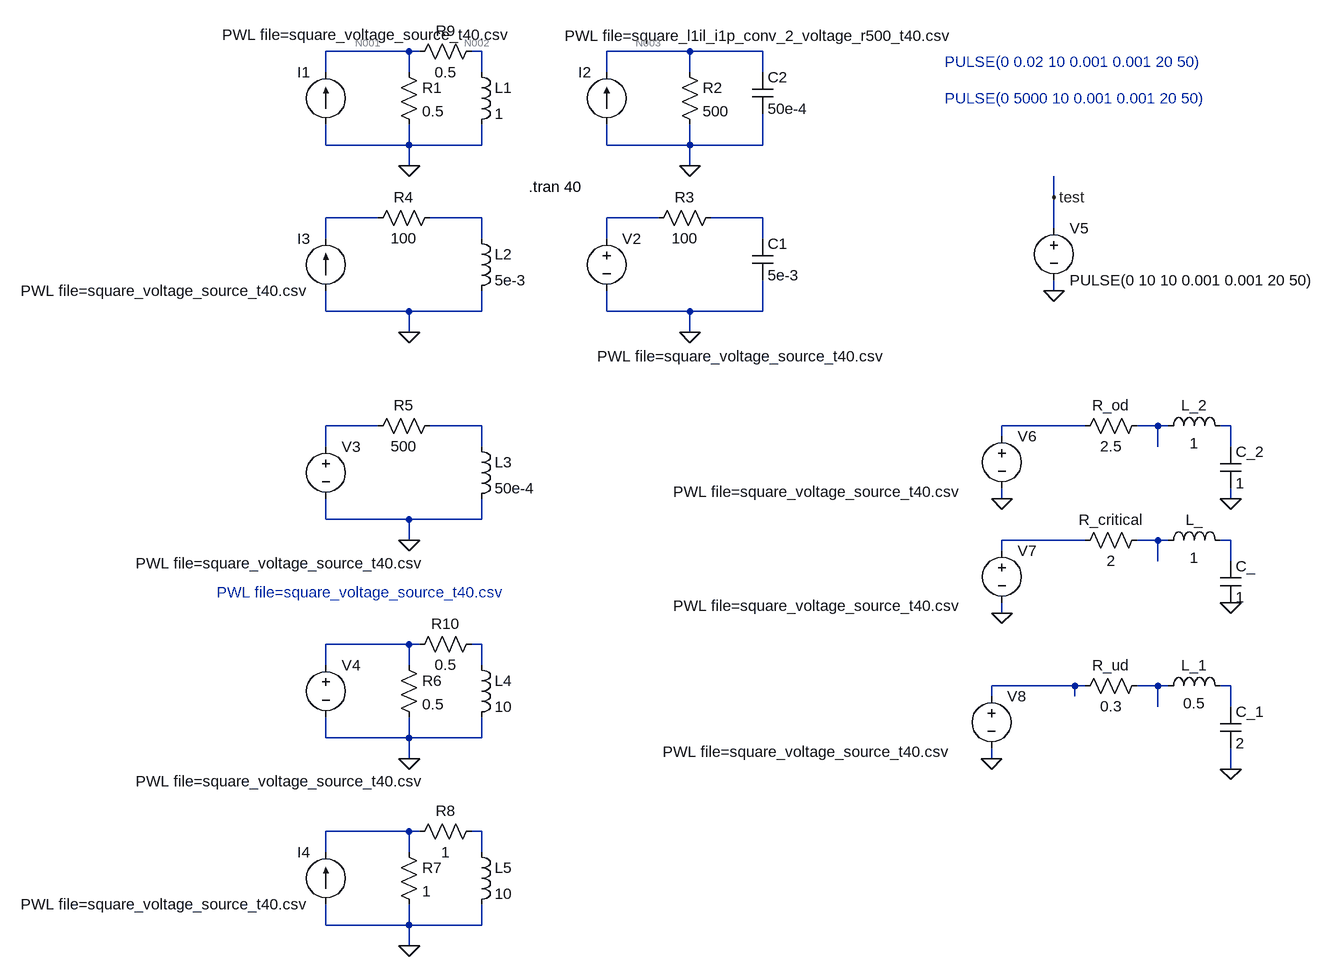
[diagram p0: schematic source_conversions.asc]
source_conversions.asc, the LTspice schematic file:
Version 4.1
SHEET 1 3944 1364
WIRE 336 -64 208 -64
WIRE 352 -64 336 -64
WIRE 448 -64 432 -64
WIRE 768 -64 640 -64
WIRE 880 -64 768 -64
WIRE 208 -32 208 -64
WIRE 336 -32 336 -64
WIRE 448 -32 448 -64
WIRE 640 -32 640 -64
WIRE 768 -32 768 -64
WIRE 880 -32 880 -64
WIRE 208 80 208 48
WIRE 336 80 336 48
WIRE 336 80 208 80
WIRE 448 80 448 48
WIRE 448 80 336 80
WIRE 640 80 640 48
WIRE 768 80 768 48
WIRE 768 80 640 80
WIRE 880 80 880 32
WIRE 880 80 768 80
WIRE 336 112 336 80
WIRE 768 112 768 80
WIRE 1328 160 1328 128
WIRE 288 192 208 192
WIRE 448 192 368 192
WIRE 720 192 640 192
WIRE 880 192 800 192
WIRE 1328 208 1328 160
WIRE 208 224 208 192
WIRE 448 224 448 192
WIRE 640 224 640 192
WIRE 880 224 880 192
WIRE 1328 304 1328 288
WIRE 208 336 208 304
WIRE 336 336 208 336
WIRE 448 336 448 304
WIRE 448 336 336 336
WIRE 640 336 640 304
WIRE 768 336 640 336
WIRE 880 336 880 288
WIRE 880 336 768 336
WIRE 336 368 336 336
WIRE 768 368 768 336
WIRE 288 512 208 512
WIRE 448 512 368 512
WIRE 1376 512 1248 512
WIRE 1488 512 1456 512
WIRE 1504 512 1488 512
WIRE 1600 512 1584 512
WIRE 1248 528 1248 512
WIRE 208 544 208 512
WIRE 448 544 448 512
WIRE 1488 544 1488 512
WIRE 1600 544 1600 512
WIRE 1248 624 1248 608
WIRE 1600 624 1600 608
WIRE 208 656 208 624
WIRE 336 656 208 656
WIRE 448 656 448 624
WIRE 448 656 336 656
WIRE 336 688 336 656
WIRE 1376 688 1248 688
WIRE 1488 688 1456 688
WIRE 1504 688 1488 688
WIRE 1600 688 1584 688
WIRE 1248 704 1248 688
WIRE 1488 720 1488 688
WIRE 1600 720 1600 688
WIRE 1248 800 1248 784
WIRE 336 848 208 848
WIRE 352 848 336 848
WIRE 448 848 432 848
WIRE 208 880 208 848
WIRE 336 880 336 848
WIRE 448 880 448 848
WIRE 1360 912 1232 912
WIRE 1376 912 1360 912
WIRE 1488 912 1456 912
WIRE 1504 912 1488 912
WIRE 1600 912 1584 912
WIRE 1232 928 1232 912
WIRE 1360 928 1360 912
WIRE 1488 944 1488 912
WIRE 1600 944 1600 912
WIRE 208 992 208 960
WIRE 336 992 336 960
WIRE 336 992 208 992
WIRE 448 992 448 960
WIRE 448 992 336 992
WIRE 336 1024 336 992
WIRE 1232 1024 1232 1008
WIRE 1600 1040 1600 1008
WIRE 336 1136 208 1136
WIRE 352 1136 336 1136
WIRE 448 1136 432 1136
WIRE 208 1168 208 1136
WIRE 336 1168 336 1136
WIRE 448 1168 448 1136
WIRE 208 1280 208 1248
WIRE 336 1280 336 1248
WIRE 336 1280 208 1280
WIRE 448 1280 448 1248
WIRE 448 1280 336 1280
WIRE 336 1312 336 1280
FLAG 336 112 0
FLAG 336 368 0
FLAG 768 112 0
FLAG 768 368 0
FLAG 336 688 0
FLAG 336 1024 0
FLAG 1600 624 0
FLAG 1600 784 0
FLAG 1600 1040 0
FLAG 1248 624 0
FLAG 1328 304 0
FLAG 1328 160 test
FLAG 1232 1024 0
FLAG 1248 800 0
FLAG 336 1312 0
SYMBOL ind 432 -48 R0
SYMATTR InstName L1
SYMATTR Value 1
SYMBOL res 320 -48 R0
SYMATTR InstName R1
SYMATTR Value 0.5
SYMBOL current 208 48 R180
WINDOW 0 24 80 Left 2
WINDOW 3 -286 138 Left 2
WINDOW 123 0 0 Left 0
WINDOW 39 0 0 Left 0
SYMATTR InstName I1
SYMATTR Value PWL file=square_voltage_source_t40.csv
SYMBOL ind 432 208 R0
SYMATTR InstName L2
SYMATTR Value 5e-3
SYMBOL res 272 208 R270
WINDOW 0 32 56 VTop 2
WINDOW 3 0 56 VBottom 2
SYMATTR InstName R4
SYMATTR Value 100
SYMBOL res 752 -48 R0
SYMATTR InstName R2
SYMATTR Value 500
SYMBOL current 640 48 R180
WINDOW 0 24 80 Left 2
WINDOW 3 -537 136 Left 2
WINDOW 123 0 0 Left 0
WINDOW 39 0 0 Left 0
SYMATTR InstName I2
SYMATTR Value PWL file=square_l1il_i1p_conv_2_voltage_r500_t40.csv
SYMBOL res 704 208 R270
WINDOW 0 32 56 VTop 2
WINDOW 3 0 56 VBottom 2
SYMATTR InstName R3
SYMATTR Value 100
SYMBOL voltage 640 208 R0
WINDOW 3 -15 197 Left 2
WINDOW 123 0 0 Left 0
WINDOW 39 0 0 Left 0
SYMATTR Value PWL file=square_voltage_source_t40.csv
SYMATTR InstName V2
SYMBOL cap 864 -32 R0
SYMATTR InstName C2
SYMATTR Value 50e-4
SYMBOL cap 864 224 R0
SYMATTR InstName C1
SYMATTR Value 5e-3
SYMBOL ind 432 528 R0
SYMATTR InstName L3
SYMATTR Value 50e-4
SYMBOL res 272 528 R270
WINDOW 0 32 56 VTop 2
WINDOW 3 0 56 VBottom 2
SYMATTR InstName R5
SYMATTR Value 500
SYMBOL voltage 208 528 R0
WINDOW 3 -293 195 Left 2
WINDOW 123 0 0 Left 0
WINDOW 39 0 0 Left 0
SYMATTR Value PWL file=square_voltage_source_t40.csv
SYMATTR InstName V3
SYMBOL ind 432 864 R0
SYMATTR InstName L4
SYMATTR Value 10
SYMBOL res 320 864 R0
SYMATTR InstName R6
SYMATTR Value 0.5
SYMBOL voltage 208 864 R0
WINDOW 3 -293 195 Left 2
WINDOW 123 0 0 Left 0
WINDOW 39 0 0 Left 0
SYMATTR Value PWL file=square_voltage_source_t40.csv
SYMATTR InstName V4
SYMBOL res 1360 704 R270
WINDOW 0 32 56 VTop 2
WINDOW 3 0 56 VBottom 2
SYMATTR InstName R_critical
SYMATTR Value 2
SYMBOL ind 1488 704 R270
WINDOW 0 32 56 VTop 2
WINDOW 3 5 56 VBottom 2
SYMATTR InstName L_
SYMATTR Value 1
SYMBOL cap 1584 720 R0
SYMATTR InstName C_
SYMATTR Value 1
SYMBOL res 1360 928 R270
WINDOW 0 32 56 VTop 2
WINDOW 3 0 56 VBottom 2
SYMATTR InstName R_ud
SYMATTR Value 0.3
SYMBOL voltage 1248 512 R0
WINDOW 3 -506 101 Left 2
WINDOW 123 0 0 Left 0
WINDOW 39 0 0 Left 0
SYMATTR Value PWL file=square_voltage_source_t40.csv
SYMATTR InstName V6
SYMBOL ind 1488 928 R270
WINDOW 0 32 56 VTop 2
WINDOW 3 5 56 VBottom 2
SYMATTR InstName L_1
SYMATTR Value 0.5
SYMBOL cap 1584 944 R0
SYMATTR InstName C_1
SYMATTR Value 2
SYMBOL res 1360 528 R270
WINDOW 0 32 56 VTop 2
WINDOW 3 0 56 VBottom 2
SYMATTR InstName R_od
SYMATTR Value 2.5
SYMBOL ind 1488 528 R270
WINDOW 0 32 56 VTop 2
WINDOW 3 5 56 VBottom 2
SYMATTR InstName L_2
SYMATTR Value 1
SYMBOL cap 1584 544 R0
SYMATTR InstName C_2
SYMATTR Value 1
SYMBOL voltage 1328 192 R0
WINDOW 123 0 0 Left 0
WINDOW 39 0 0 Left 0
SYMATTR InstName V5
SYMATTR Value PULSE(0 10 10 0.001 0.001 20 50)
SYMBOL voltage 1232 912 R0
WINDOW 3 -506 101 Left 2
WINDOW 123 0 0 Left 0
WINDOW 39 0 0 Left 0
SYMATTR Value PWL file=square_voltage_source_t40.csv
SYMATTR InstName V8
SYMBOL voltage 1248 688 R0
WINDOW 3 -506 101 Left 2
WINDOW 123 0 0 Left 0
WINDOW 39 0 0 Left 0
SYMATTR Value PWL file=square_voltage_source_t40.csv
SYMATTR InstName V7
SYMBOL current 208 304 R180
WINDOW 0 24 80 Left 2
WINDOW 3 24 0 Left 2
WINDOW 123 0 0 Left 0
WINDOW 39 0 0 Left 0
SYMATTR InstName I3
SYMATTR Value PWL file=square_voltage_source_t40.csv
SYMBOL ind 432 1152 R0
SYMATTR InstName L5
SYMATTR Value 10
SYMBOL res 320 1152 R0
SYMATTR InstName R7
SYMATTR Value 1
SYMBOL current 208 1248 R180
WINDOW 0 24 80 Left 2
WINDOW 3 24 0 Left 2
WINDOW 123 0 0 Left 0
WINDOW 39 0 0 Left 0
SYMATTR InstName I4
SYMATTR Value PWL file=square_voltage_source_t40.csv
SYMBOL res 448 1120 R90
WINDOW 0 0 56 VBottom 2
WINDOW 3 32 56 VTop 2
SYMATTR InstName R8
SYMATTR Value 1
SYMBOL res 448 -80 R90
WINDOW 0 0 56 VBottom 2
WINDOW 3 32 56 VTop 2
SYMATTR InstName R9
SYMATTR Value 0.5
SYMBOL res 448 832 R90
WINDOW 0 0 56 VBottom 2
WINDOW 3 32 56 VTop 2
SYMATTR InstName R10
SYMATTR Value 0.5
TEXT 520 144 Left 2 !.tran 40
TEXT 1160 -48 Left 2 ;PULSE(0 0.02 10 0.001 0.001 20 50)
TEXT 1160 8 Left 2 ;PULSE(0 5000 10 0.001 0.001 20 50)
TEXT 40 768 Left 2 ;PWL file=square_voltage_source_t40.csv

The netlist it stands for:
* source_conversions.asc
L1 N002 0 1
R1 N001 0 0.5
I1 0 N001 PWL file=square_voltage_source_t40.csv
L2 N005 0 5e-3
R4 N004 N005 100
R2 N003 0 500
I2 0 N003 PWL file=square_l1il_i1p_conv_2_voltage_r500_t40.csv
R3 N006 N007 100
V2 N006 0 PWL file=square_voltage_source_t40.csv
C2 N003 0 50e-4
C1 N007 0 5e-3
L3 N009 0 50e-4
R5 N008 N009 500
V3 N008 0 PWL file=square_voltage_source_t40.csv
L4 N017 0 10
R6 N016 0 0.5
V4 N016 0 PWL file=square_voltage_source_t40.csv
R_critical N013 N014 2
L_ N014 N015 1
C_ N015 0 1
R_ud N018 N019 0.3
V6 N010 0 PWL file=square_voltage_source_t40.csv
L_1 N019 N020 0.5
C_1 N020 0 2
R_od N010 N011 2.5
L_2 N011 N012 1
C_2 N012 0 1
V5 test 0 PULSE(0 10 10 0.001 0.001 20 50)
V8 N018 0 PWL file=square_voltage_source_t40.csv
V7 N013 0 PWL file=square_voltage_source_t40.csv
I3 0 N004 PWL file=square_voltage_source_t40.csv
L5 N022 0 10
R7 N021 0 1
I4 0 N021 PWL file=square_voltage_source_t40.csv
R8 N022 N021 1
R9 N002 N001 0.5
R10 N017 N016 0.5
.tran 40
* PULSE(0 0.02 10 0.001 0.001 20 50)
* PULSE(0 5000 10 0.001 0.001 20 50)
* PWL file=square_voltage_source_t40.csv
.backanno
.end

* Results of the author's LTspice run, read from the files saved beside the schematic
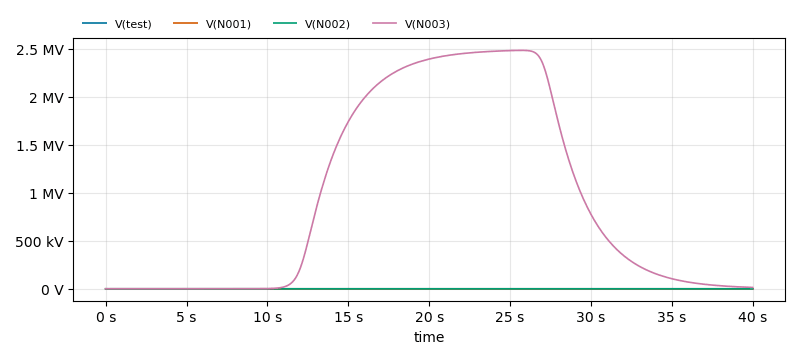
[diagram p1: Transient Analysis of source_conversions.asc, plotted from the saved traces]
* Transient Analysis, 1 run:
*   V(test): min 0 V, max 10 V, average 5 V, rms 7.071 V, last 0 V
*   V(N001): min -1.04 V, max 3.466 V, average 923.2 mV, rms 1.585 V, last -3.74 µV
*   V(N002): min -2.566 V, max 2.407 V, average 1.886 mV, rms 624.5 mV, last -7.481 µV
*   V(N003): min 16.18 V, max 2.486 MV, average 941.8 kV, rms 1.397 MV, last 14.24 kV